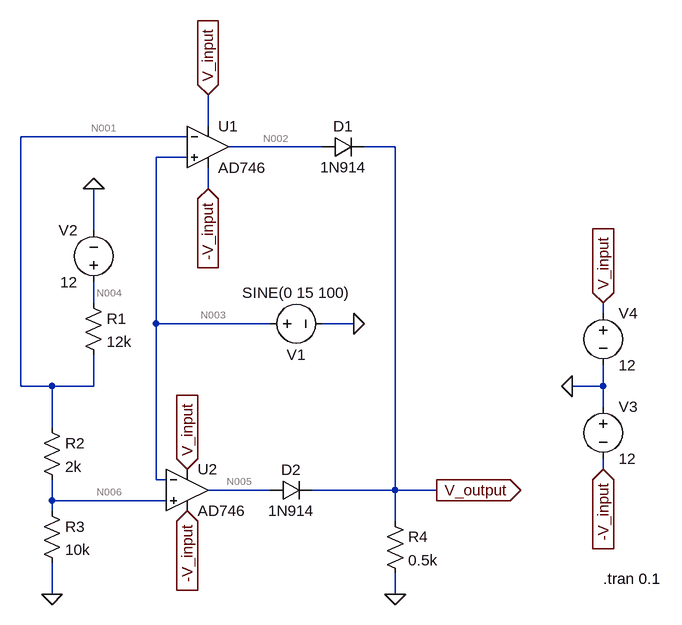
[diagram p0: schematic компаратор с окном.asc]
компаратор с окном.asc, the LTspice schematic file:
Version 4
SHEET 1 920 680
WIRE -64 -192 -64 -240
WIRE -96 -176 -352 -176
WIRE 112 -160 -32 -160
WIRE 224 -160 176 -160
WIRE -96 -144 -144 -144
WIRE -64 -96 -64 -128
WIRE -240 -32 -240 -96
WIRE -240 80 -240 48
WIRE 544 96 544 80
WIRE -144 112 -144 -144
WIRE 32 112 -144 112
WIRE 160 112 112 112
WIRE -352 208 -352 -176
WIRE -304 208 -352 208
WIRE -240 208 -240 160
WIRE -240 208 -304 208
WIRE 544 208 544 176
WIRE 544 208 496 208
WIRE 544 240 544 208
WIRE -304 272 -304 208
WIRE 544 336 544 320
WIRE -144 352 -144 112
WIRE -128 352 -144 352
WIRE 32 368 -64 368
WIRE 224 368 224 -160
WIRE 224 368 96 368
WIRE 288 368 224 368
WIRE -304 384 -304 352
WIRE -128 384 -304 384
WIRE -304 400 -304 384
WIRE 224 416 224 368
WIRE -304 528 -304 480
WIRE 224 528 224 496
FLAG -64 -240 V_input
IOPIN -64 -240 In
FLAG -64 -96 -V_input
IOPIN -64 -96 In
FLAG 288 368 V_output
IOPIN 288 368 Out
FLAG 496 208 0
FLAG 544 80 V_input
IOPIN 544 80 In
FLAG 544 336 -V_input
IOPIN 544 336 In
FLAG -304 528 0
FLAG 160 112 0
FLAG -240 -96 0
FLAG -96 336 V_input
IOPIN -96 336 In
FLAG -96 400 -V_input
IOPIN -96 400 In
FLAG 224 528 0
SYMBOL Opamps\\AD746 -64 -224 R0
SYMATTR InstName U1
SYMBOL voltage 544 224 R0
WINDOW 123 0 0 Left 0
WINDOW 39 0 0 Left 0
SYMATTR InstName V3
SYMATTR Value 12
SYMBOL voltage 544 80 R0
WINDOW 123 0 0 Left 0
WINDOW 39 0 0 Left 0
SYMATTR InstName V4
SYMATTR Value 12
SYMBOL res -256 64 R0
SYMATTR InstName R1
SYMATTR Value 12k
SYMBOL res -320 256 R0
SYMATTR InstName R2
SYMATTR Value 2k
SYMBOL res -320 384 R0
SYMATTR InstName R3
SYMATTR Value 10k
SYMBOL diode 112 -144 R270
WINDOW 0 32 32 VTop 2
WINDOW 3 0 32 VBottom 2
SYMATTR InstName D1
SYMATTR Value 1N914
SYMBOL voltage 16 112 R270
WINDOW 0 -32 56 VBottom 2
WINDOW 3 32 56 VTop 2
WINDOW 123 0 0 Left 0
WINDOW 39 0 0 Left 0
SYMATTR InstName V1
SYMATTR Value SINE(0 15 100)
SYMBOL voltage -240 64 R180
WINDOW 0 24 96 Left 2
WINDOW 3 24 16 Left 2
WINDOW 123 0 0 Left 0
WINDOW 39 0 0 Left 0
SYMATTR InstName V2
SYMATTR Value 12
SYMBOL Opamps\\AD746 -96 304 R0
SYMATTR InstName U2
SYMBOL res 208 400 R0
SYMATTR InstName R4
SYMATTR Value 0.5k
SYMBOL diode 32 384 R270
WINDOW 0 32 32 VTop 2
WINDOW 3 0 32 VBottom 2
SYMATTR InstName D2
SYMATTR Value 1N914
TEXT 544 504 Left 2 !.tran 0.1

The netlist it stands for:
* компаратор с окном.asc
XU1 N003 N001 V_input -V_input N002 AD746  ; pins In+ In- V+ V- OUT
V3 0 -V_input 12
V4 V_input 0 12
R1 N004 N001 12k
R2 N001 N006 2k
R3 N006 0 10k
D1 N002 V_output 1N914
V1 N003 0 SINE(0 15 100)
V2 N004 0 12
XU2 N006 N003 V_input -V_input N005 AD746  ; pins In+ In- V+ V- OUT
R4 V_output 0 0.5k
D2 N005 V_output 1N914
.model D D
.lib standard.dio
.tran 0.1
.backanno
.end

* Results of the author's LTspice run, read from the files saved beside the schematic
* Operating Point, zero values left out:
*   V(n001) = 6 V
*   V(v_input) = 12 V
*   V(n002) = -11.91 V
*   V(-v_input) = -12 V
*   V(n004) = 12 V
*   V(n006) = 5 V
*   V(v_output) = 9.269 V
*   V(n005) = 9.996 V
*   I(D2) = 18.54 mA
*   I(D1) = -2.541 nA
*   I(R4) = 18.54 mA
*   I(R3) = 500 µA
*   I(R2) = 500 µA
*   I(R1) = 500 µA
*   I(V2) = -500 µA
*   I(V1) = -220 pA
*   I(V4) = -27.71 mA
*   I(V3) = -9.229 mA
*   Ix(u1:1) = 110 pA
*   Ix(u1:2) = 302 pA
*   Ix(u1:3) = 4.745 mA
*   Ix(u1:4) = -4.625 mA
*   Ix(u1:5) = 2.565 nA
*   Ix(u2:1) = 270 pA
*   Ix(u2:2) = 110 pA
*   Ix(u2:3) = 22.96 mA
*   Ix(u2:4) = -4.604 mA
*   Ix(u2:5) = -18.54 mA
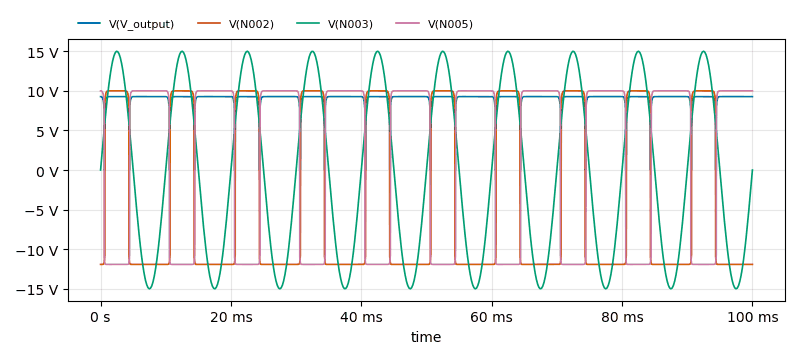
[diagram p1: Transient Analysis of компаратор с окном.asc, plotted from the saved traces]
* Transient Analysis, 1 run:
*   V(V_output): min -10.79 mV, max 9.27 V, average 8.987 V, rms 9.096 V, last 9.269 V
*   V(N002): min -11.91 V, max 9.996 V, average -3.847 V, rms 11.2 V, last -11.91 V
*   V(N003): min -15 V, max 15 V, average 1.081 mV, rms 10.6 V, last 0 V
*   V(N005): min -11.91 V, max 9.997 V, average 1.395 V, rms 10.74 V, last 9.996 V